# EAGLE design Schematic (EAGLE 9.5.2)
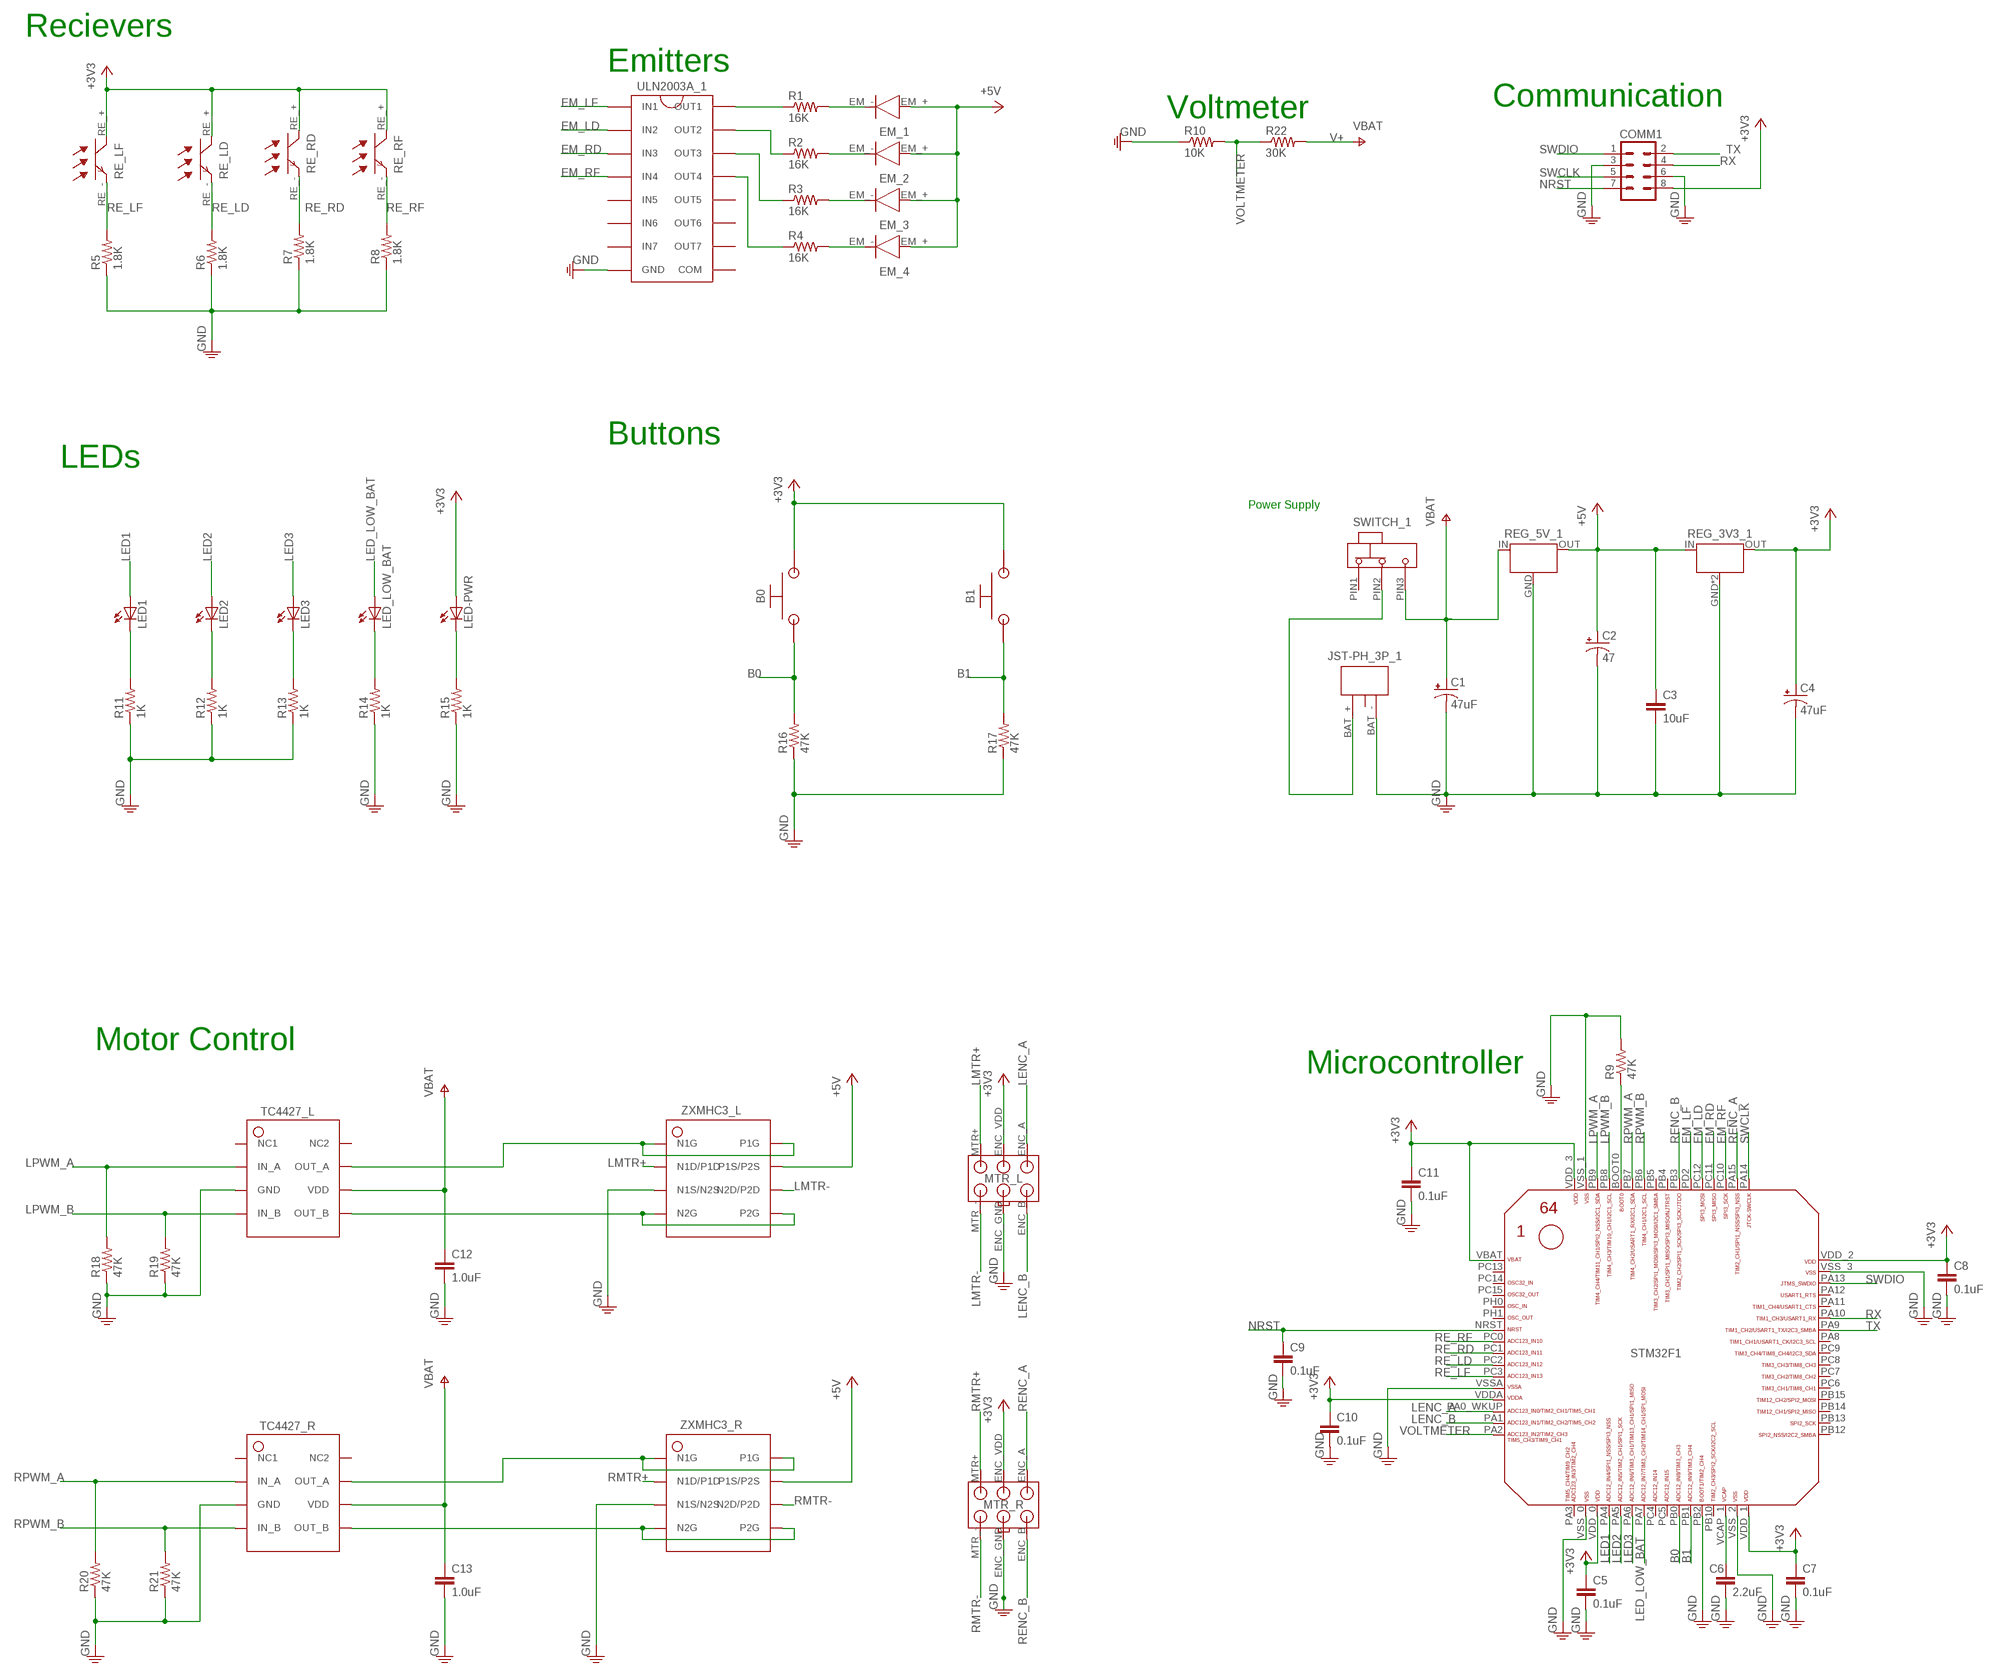
[diagram p0: schematic, sheet 1]

## Parts
B0  POLOLU_BUTTON  [POLOLU_BUTTON]
B1  POLOLU_BUTTON  [POLOLU_BUTTON]
C1  47uF  CAP_TANT_1210IN_3528MM  [CAP_TANT_1210IN_3528MM]
C2  47  CAP_TANT_1210IN_3528MM  [CAP_TANT_1210IN_3528MM]
C3  10uF  CAP_CERAMIC_0805IN_2012MM  [0805]
C4  47uF  CAP_TANT_1210IN_3528MM  [CAP_TANT_1210IN_3528MM]
C5  0.1uF  CAP_CERAMIC_0805IN_2012MM  [0805]
C6  2.2uF  CAP_CERAMIC_0805IN_2012MM  [0805]
C7  0.1uF  CAP_CERAMIC_0805IN_2012MM  [0805]
C8  0.1uF  CAP_CERAMIC_0805IN_2012MM  [0805]
C9  0.1uF  CAP_CERAMIC_0805IN_2012MM  [0805]
C10  0.1uF  CAP_CERAMIC_0805IN_2012MM  [0805]
C11  0.1uF  CAP_CERAMIC_0805IN_2012MM  [0805]
C12  1.0uF  CAP_CERAMIC_0805IN_2012MM  [0805]
C13  1.0uF  CAP_CERAMIC_0805IN_2012MM  [0805]
COMM1  M04X2  [2X4]
EM_1  SFH4545  [EMITTER]
EM_2  SFH4545  [EMITTER]
EM_3  SFH4545  [EMITTER]
EM_4  SFH4545  [EMITTER]
JST-PH_3P_1  3PIN  [B3B-PH-K-S]
LED1  LED  [LED-0805]
LED2  LED  [LED-0805]
LED3  LED  [LED-0805]
LED-PWR  LED  [LED-0805]
LED_LOW_BAT  LED  [LED-0805]
MTR_L  MOTOR_ENCODER_HEADER  [MOTOR_ENCODER_HEADER]
MTR_R  MOTOR_ENCODER_HEADER  [MOTOR_ENCODER_HEADER]
R1  16K  RESISTOR_0805IN_2012MM  [0805]
R2  16K  RESISTOR_0805IN_2012MM  [0805]
R3  16K  RESISTOR_0805IN_2012MM  [0805]
R4  16K  RESISTOR_0805IN_2012MM  [0805]
R5  1.8K  RESISTOR_0805IN_2012MM  [0805]
R6  1.8K  RESISTOR_0805IN_2012MM  [0805]
R7  1.8K  RESISTOR_0805IN_2012MM  [0805]
R8  1.8K  RESISTOR_0805IN_2012MM  [0805]
R9  47K  RESISTOR_0805IN_2012MM  [0805]
R10  10K  RESISTOR_0805IN_2012MM  [0805]
R11  1K  RESISTOR_0805IN_2012MM  [0805]
R12  1K  RESISTOR_0805IN_2012MM  [0805]
R13  1K  RESISTOR_0805IN_2012MM  [0805]
R14  1K  RESISTOR_0805IN_2012MM  [0805]
R15  1K  RESISTOR_0805IN_2012MM  [0805]
R16  47K  RESISTOR_0805IN_2012MM  [0805]
R17  47K  RESISTOR_0805IN_2012MM  [0805]
R18  47K  RESISTOR_0805IN_2012MM  [0805]
R19  47K  RESISTOR_0805IN_2012MM  [0805]
R20  47K  RESISTOR_0805IN_2012MM  [0805]
R21  47K  RESISTOR_0805IN_2012MM  [0805]
R22  30K  RESISTOR_0805IN_2012MM  [0805]
RE_LD  TEFT4300  [RECEIVER]
RE_LF  TEFT4300  [RECEIVER]
RE_RD  TEFT4300  [RECEIVER]
RE_RF  TEFT4300  [RECEIVER]
REG_3V3_1  3V3_REG  [SOT223]
REG_5V_1  REG_5V_MURATA  [5V_REG_MURATA]
STM32F1  STM32F4_401_410_411_412_413_446  [LQFP64]
SWITCH_1  POLOLU_SWITCH  [POLOLU_SWITCH]
TC4427_L  TC4427_SOIC8  [TC4427_SOIC8]
TC4427_R  TC4427_SOIC8  [TC4427_SOIC8]
ULN2003A_1  ULN2003A  [ULN2003A]
ZXMHC3_L  ZXMHC3  [ZXMHC3]
ZXMHC3_R  ZXMHC3  [ZXMHC3]

## Nets
+3V3: B0.P$2 B1.P$2 C4.A(+) C5.1 C7.1 C8.1 C10.1 C11.1 COMM1.8 LED-PWR.A MTR_L.ENC_VDD MTR_R.ENC_VDD RE_LD.RE_+(C) RE_LF.RE_+(C) RE_RD.RE_+(C) RE_RF.RE_+(C) REG_3V3_1.OUT STM32F1.VBAT STM32F1.VDD_0 STM32F1.VDD_1 STM32F1.VDD_2 STM32F1.VDD_3 STM32F1.VDDA
+5V: C2.A(+) C3.1 EM_1.EM_+(+) EM_2.EM_+(+) EM_3.EM_+(+) EM_4.EM_+(+) REG_3V3_1.IN REG_5V_1.OUT ZXMHC3_L.P1S/P2S ZXMHC3_R.P1S/P2S
B0: B0.P$1 R16.2 STM32F1.PB0
B1: B1.P$1 R17.2 STM32F1.PB1
EM_LD: STM32F1.PC12 ULN2003A_1.2B(IN2)
EM_LF: STM32F1.PD2 ULN2003A_1.1B(IN1)
EM_RD: STM32F1.PC11 ULN2003A_1.3B(IN3)
EM_RF: STM32F1.PC10 ULN2003A_1.4B(IN4)
GND: C1.C(-) C2.C(-) C3.2 C4.C(-) C5.2 C6.2 C7.2 C8.2 C9.2 C10.2 C11.2 C12.2 C13.2 COMM1.3 COMM1.6 JST-PH_3P_1.BAT_- MTR_L.ENC_GND MTR_R.ENC_GND R5.1 R6.1 R7.1 R8.1 R9.2 R10.1 R11.1 R12.1 R13.1 R14.1 R15.1 R16.1 R17.1 R18.1 R19.1 R20.1 R21.1 REG_3V3_1.GND REG_3V3_1.GND2(GND) REG_5V_1.GND STM32F1.PB2 STM32F1.VSS_0 STM32F1.VSS_1 STM32F1.VSS_2(VCAP_1) STM32F1.VSS_3(VCAP_2) STM32F1.VSSA TC4427_L.GND TC4427_R.GND ULN2003A_1.GND ZXMHC3_L.N1S/N2S ZXMHC3_R.N1S/N2S
LED1: LED1.A STM32F1.PA4
LED2: LED2.A STM32F1.PA5
LED3: LED3.A STM32F1.PA6
LED_LOW_BAT: LED_LOW_BAT.A STM32F1.PA7
LENC_A: MTR_L.ENC_A STM32F1.PA0_WKUP(PA0_AKUP)
LENC_B: MTR_L.ENC_B STM32F1.PA1
LMTR+: MTR_L.MTR+(MTR_+) ZXMHC3_L.N1D/P1D
LMTR-: MTR_L.MTR_- ZXMHC3_L.N2D/P2D
LPWM_A: R18.2 STM32F1.PB9 TC4427_L.IN_A
LPWM_B: R19.2 STM32F1.PB8 TC4427_L.IN_B
N$1: R1.1 ULN2003A_1.1C(OUT1)
N$2: R2.1 ULN2003A_1.2C(OUT2)
N$3: R3.1 ULN2003A_1.3C(OUT3)
N$4: R4.1 ULN2003A_1.4C(OUT4)
N$5: EM_1.EM_-(-) R1.2
N$6: EM_2.EM_-(-) R2.2
N$7: EM_3.EM_-(-) R3.2
N$8: EM_4.EM_-(-) R4.2
N$9: JST-PH_3P_1.BAT_+ SWITCH_1.PIN2
N$15: R9.1 STM32F1.BOOT0
N$16: C6.1 STM32F1.VCAP_1(PB11)
N$17: TC4427_L.OUT_B ZXMHC3_L.N2G ZXMHC3_L.P2G
N$18: TC4427_L.OUT_A ZXMHC3_L.N1G ZXMHC3_L.P1G
N$19: TC4427_R.OUT_A ZXMHC3_R.N1G ZXMHC3_R.P1G
N$20: TC4427_R.OUT_B ZXMHC3_R.N2G ZXMHC3_R.P2G
N$21: LED1.C R11.2
N$22: LED2.C R12.2
N$23: LED3.C R13.2
N$24: LED_LOW_BAT.C R14.2
N$25: LED-PWR.C R15.2
NRST: C9.1 COMM1.7 STM32F1.NRST
RE_LD: R6.2 RE_LD.RE_-(E) STM32F1.PC2
RE_LF: R5.2 RE_LF.RE_-(E) STM32F1.PC3
RE_RD: R7.2 RE_RD.RE_-(E) STM32F1.PC1
RE_RF: R8.2 RE_RF.RE_-(E) STM32F1.PC0
RENC_A: MTR_R.ENC_A STM32F1.PA15
RENC_B: MTR_R.ENC_B STM32F1.PB3
RMTR+: MTR_R.MTR+(MTR_+) ZXMHC3_R.N1D/P1D
RMTR-: MTR_R.MTR_- ZXMHC3_R.N2D/P2D
RPWM_A: R20.2 STM32F1.PB7 TC4427_R.IN_A
RPWM_B: R21.2 STM32F1.PB6 TC4427_R.IN_B
RX: COMM1.4 STM32F1.PA10
SWCLK: COMM1.5 STM32F1.PA14
SWDIO: COMM1.1 STM32F1.PA13
TX: COMM1.2 STM32F1.PA9
V+: C1.A(+) C12.1 C13.1 R22.2 REG_5V_1.IN SWITCH_1.PIN3 TC4427_L.VDD TC4427_R.VDD ; supply symbol labelled VBAT
VOLTMETER: R10.2 R22.1 STM32F1.PA2
Unconnected: STM32F1.PA3 STM32F1.PA8 STM32F1.PA11 STM32F1.PA12 STM32F1.PB4 STM32F1.PB5 STM32F1.PB10 STM32F1.PB12 STM32F1.PB13 STM32F1.PB14 STM32F1.PB15 STM32F1.PC4 STM32F1.PC5 STM32F1.PC6 STM32F1.PC7 STM32F1.PC8 STM32F1.PC9 STM32F1.PC13 STM32F1.PC14 STM32F1.PC15 STM32F1.PH0 STM32F1.PH1 SWITCH_1.PIN1 TC4427_L.NC1 TC4427_L.NC2 TC4427_R.NC1 TC4427_R.NC2 ULN2003A_1.5B(IN5) ULN2003A_1.5C(OUT5) ULN2003A_1.6B(IN6) ULN2003A_1.6C(OUT6) ULN2003A_1.7B(IN7) ULN2003A_1.7C(OUT7) ULN2003A_1.COM

## Notes on the sheet
- Recievers
- Emitters
- Communication
- Voltmeter
- Buttons
- LEDs
- Power Supply
- Motor Control
- Microcontroller

## Library data of the parts
B0 B1 = POLOLU_BUTTON:POLOLU_BUTTON
C1 C2 C4 = CAP_TANT_1210IN_3528MM:CAP_TANT_1210IN_3528MM
C3 C5-C13 = CAP_CERAMIC_0805IN_2012MM:CAP_CERAMIC_0805IN_2012MM
COMM1 = 2X4_PIN_HEADER:M04X2
EM_1-EM_4 = SFH4545:SFH4545
JST-PH_3P_1 = BATT_JST-PH_3PIN:3PIN
LED1-LED3 LED-PWR LED_LOW_BAT = LED_0805:LED
MTR_L MTR_R = MOTOR_ENCODER_HEADER:MOTOR_ENCODER_HEADER
R1-R22 = RESISTOR_0805IN_2012MM:RESISTOR_0805IN_2012MM
RE_LD RE_LF RE_RD RE_RF = TEFT4300:TEFT4300
REG_3V3_1 = REG_3V3_LM3940:3V3_REG: 1A Low Dropout Regulator for 5V to 3.3V Conversion
REG_5V_1 = REG_5V_MURATA:REG_5V_MURATA
STM32F1 = STM32F4_401_410_411_412_413_446:STM32F4_401_410_411_412_413_446
SWITCH_1 = POLOLU_SWITCH:POLOLU_SWITCH
TC4427_L TC4427_R = TC4427:TC4427_SOIC8
ULN2003A_1 = ULN2003A:ULN2003A
ZXMHC3_L ZXMHC3_R = ZXMHC3:ZXMHC3

## Board
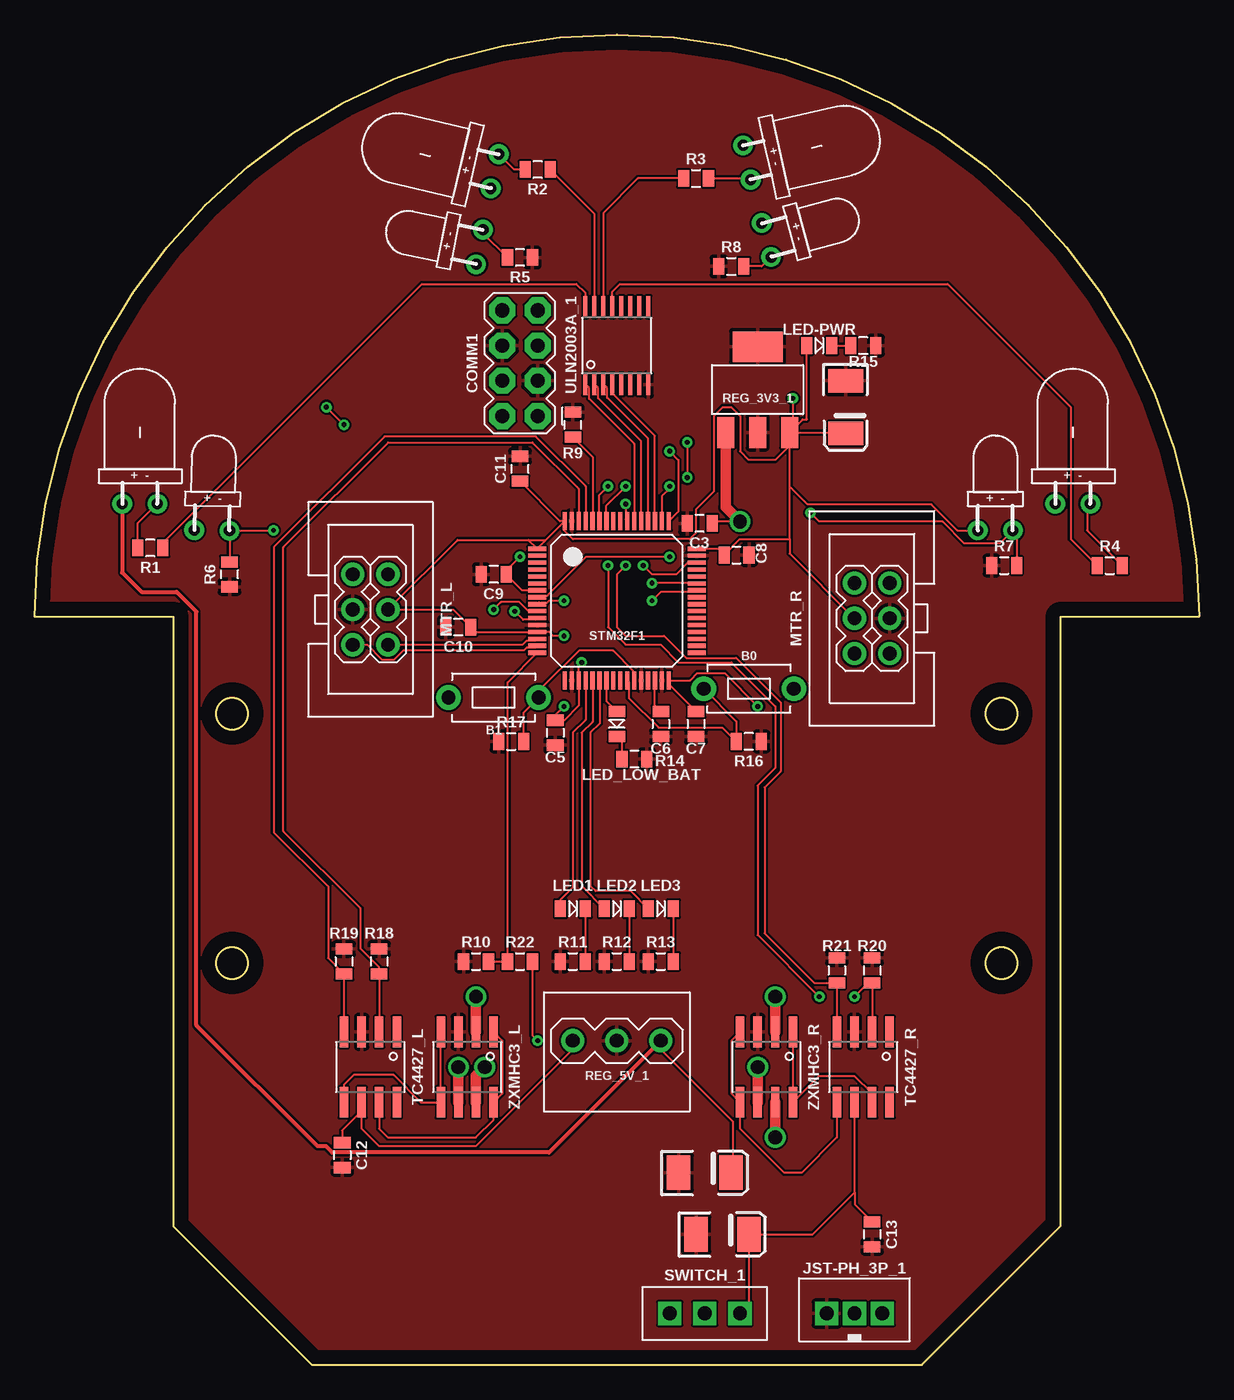
[diagram p1: board, top side]
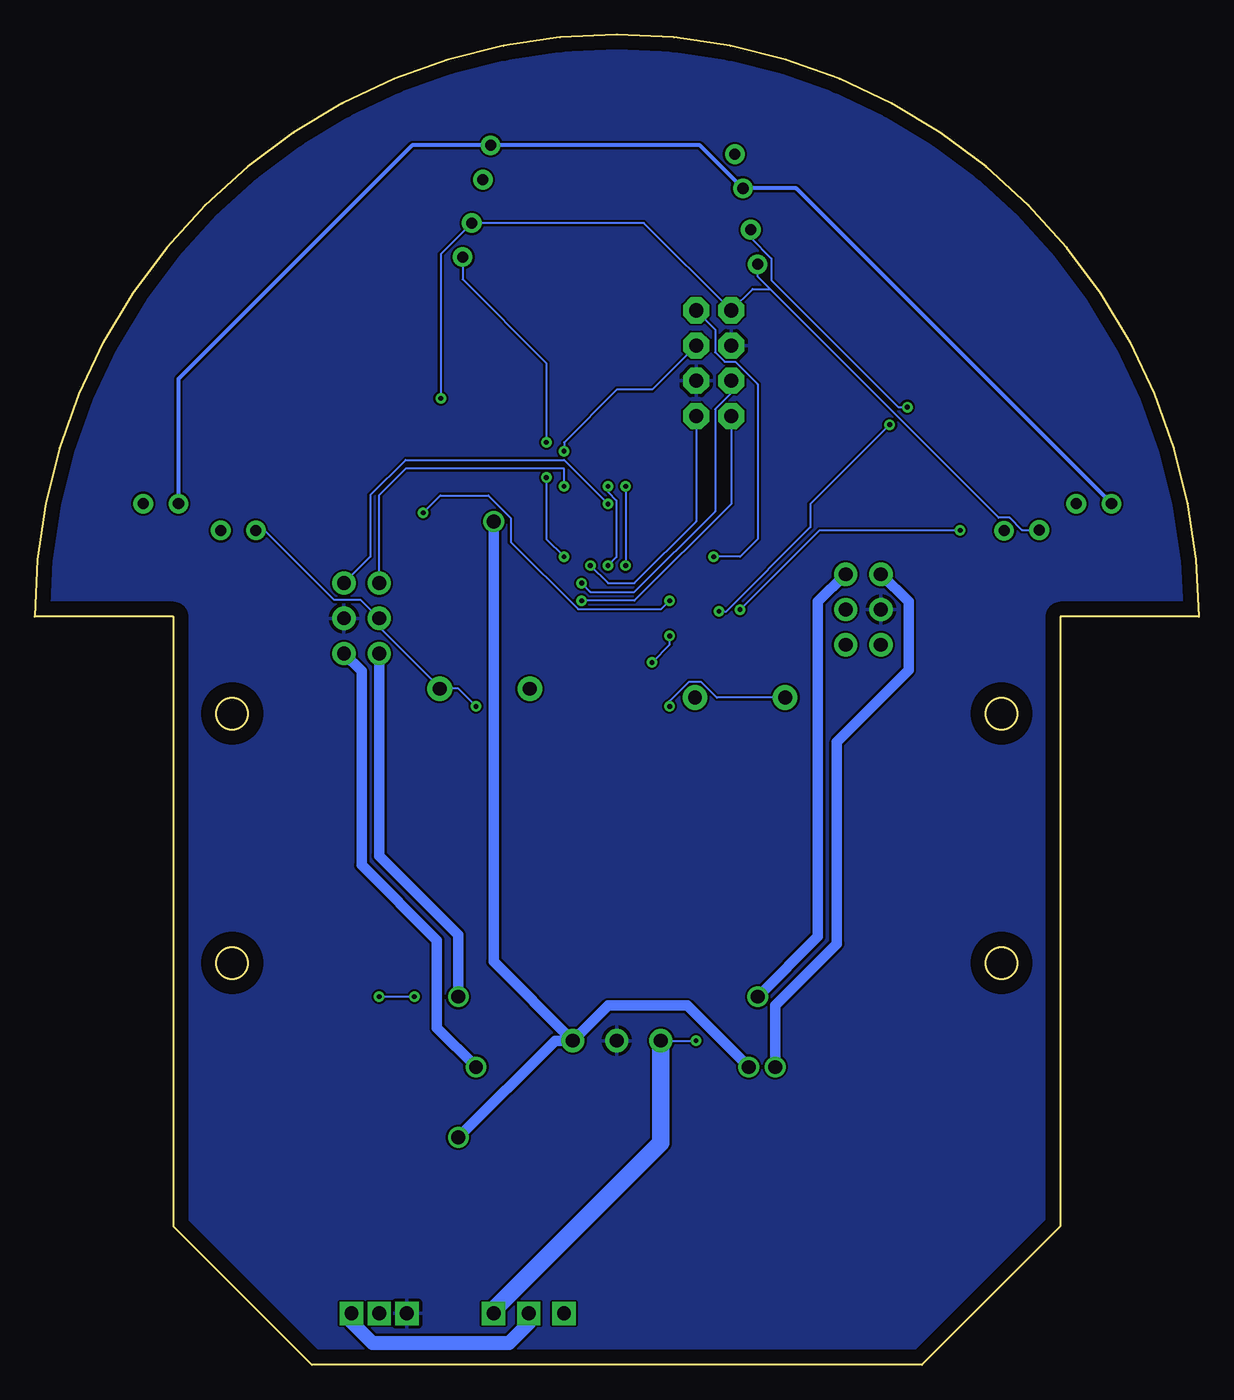
[diagram p2: board, bottom side, seen from below]

Size 84 x 96 mm. Coordinates in mm from the lower left corner, seen from the top.
Copper layers (1*16): Top 0.035mm / dielectric 1.5mm / Bottom 0.035mm
Design rules "default": minimum track width 6mil, minimum drill 0.35mm, track to track 6mil, track to pad 6mil, pad to pad 6mil, via to via 6mil, smd to smd 6mil, copper to edge 40mil, drill to drill 6mil, minimum pad ring 10mil, minimum via ring 8mil, stop-mask expansion 4mil, vias tented up to drill 0mil, thermal gap 10mil

### Footprints (pad centres in the part's own frame; a part is rotated, then mirrored left to right if it is on the bottom)
POLOLU_BUTTON = drill 1 pad 1.778: P$1 -3.25,0; P$2 3.25,0
CAP_TANT_1210IN_3528MM = smd 1.7 x 2.5: A 1.9,0; C -1.9,0
0805 = smd 0.8 x 1.2: 1 -0.9,0; 2 0.9,0
2X4 = drill 1.016 pad 1.88 octagon: 1 -3.81,-1.27; 2 -3.81,1.27; 3 -1.27,-1.27; 4 -1.27,1.27; 5 1.27,-1.27; 6 1.27,1.27; 7 3.81,-1.27; 8 3.81,1.27
EMITTER = drill 0.8 pad 1.422: EM_+ -1.397,0.016; EM_- 1.143,0.016
B3B-PH-K-S = drill 1 pad 1.676 square: BAT_+ 2,0; BAT_- -2,0; NC 0,0
LED-0805 = smd 0.8 x 1.2: A -0.9,0; C 0.9,0
MOTOR_ENCODER_HEADER = drill 1 pad 1.676: ENC_A 2.54,1.27; ENC_B 2.54,-1.27; ENC_GND 0,-1.27; ENC_VDD 0,1.27; MTR+ -2.54,1.27; MTR_- -2.54,-1.27
RECEIVER = drill 0.8 pad 1.422: RE_+ -1.27,0; RE_- 1.27,0
SOT223 = smd 1.219 x 2.235: GND 0,-3.099; IN -2.311,-3.099; OUT 2.311,-3.099 | smd 3.6 x 2.2: GND2 0,3.099
5V_REG_MURATA = drill 1 pad 1.676: GND 0,0; IN -3.175,0; OUT 3.175,0
LQFP64 = smd 0.3 x 1.3: BOOT0 -1.75,5.75; PA3 -3.75,-5.75; PA4 -2.25,-5.75; PA5 -1.75,-5.75; PA6 -1.25,-5.75; PA7 -0.75,-5.75; PA14 3.75,5.75; PA15 3.25,5.75; PB0 0.75,-5.75; PB1 1.25,-5.75; PB2 1.75,-5.75; PB3 0.75,5.75; PB4 0.25,5.75; PB5 -0.25,5.75; PB6 -0.75,5.75; PB7 -1.25,5.75; PB8 -2.25,5.75; PB9 -2.75,5.75; PB10 2.25,-5.75; PC4 -0.25,-5.75; PC5 0.25,-5.75; PC10 2.75,5.75; PC11 2.25,5.75; PC12 1.75,5.75; PD2 1.25,5.75; VCAP_1 2.75,-5.75; VDD_0 -2.75,-5.75; VDD_1 3.75,-5.75; VDD_3 -3.75,5.75; VSS_0 -3.25,-5.75; VSS_1 -3.25,5.75; VSS_2 3.25,-5.75 | smd 1.3 x 0.3: NRST -5.75,0.75; PA0_WKUP -5.75,-2.75; PA1 -5.75,-3.25; PA2 -5.75,-3.75; PA8 5.75,0.25; PA9 5.75,0.75; PA10 5.75,1.25; PA11 5.75,1.75; PA12 5.75,2.25; PA13 5.75,2.75; PB12 5.75,-3.75; PB13 5.75,-3.25; PB14 5.75,-2.75; PB15 5.75,-2.25; PC0 -5.75,0.25; PC1 -5.75,-0.25; PC2 -5.75,-0.75; PC3 -5.75,-1.25; PC6 5.75,-1.75; PC7 5.75,-1.25; PC8 5.75,-0.75; PC9 5.75,-0.25; PC13 -5.75,3.25; PC14 -5.75,2.75; PC15 -5.75,2.25; PH0 -5.75,1.75; PH1 -5.75,1.25; VBAT -5.75,3.75; VDD_2 5.75,3.75; VDDA -5.75,-2.25; VSS_3 5.75,3.25; VSSA -5.75,-1.75
POLOLU_SWITCH = drill 1 pad 1.676 square: PIN1 -2.54,0; PIN2 0,0; PIN3 2.54,0
TC4427_SOIC8 = smd 0.61 x 2.21: GND 0.635,-2.54; IN_A -0.635,-2.54; IN_B 1.905,-2.54; NC1 -1.905,-2.54; NC2 -1.905,2.54; OUT_A -0.635,2.54; OUT_B 1.905,2.54; VDD 0.635,2.54
ULN2003A = smd 1.55 x 0.3: 1B -2.8,2.275; 1C 2.8,2.275; 2B -2.8,1.625; 2C 2.8,1.625; 3B -2.8,0.975; 3C 2.8,0.975; 4B -2.8,0.325; 4C 2.8,0.325; 5B -2.8,-0.325; 5C 2.8,-0.325; 6B -2.8,-0.975; 6C 2.8,-0.975; 7B -2.8,-1.625; 7C 2.8,-1.625; COM 2.8,-2.275; GND -2.8,-2.275
ZXMHC3 = smd 0.61 x 2.21: N1D/P1D -0.635,-2.54; N1G -1.905,-2.54; N1S/N2S 0.635,-2.54; N2D/P2D 0.635,2.54; N2G 1.905,-2.54; P1G -1.905,2.54; P1S/P2S -0.635,2.54; P2G 1.905,2.54

### Placement (x,y rotation side)
B0  51.52,48.8 0 top
B1  33.11,48.16 180 top
C1  49.62,9.43 0 top
C2  48.35,13.87 0 top
C3  47.97,60.73 180 top
C4  58.51,69.11 270 top
C5  37.55,45.62 270 top
C6  45.17,46.25 270 top
C7  47.71,46.25 270 top
C8  50.64,58.45 0 top
C9  33.11,57.05 180 top
C10  30.57,53.24 180 top
C11  35.02,64.67 90 top
C12  22.19,15.14 270 top
C13  60.41,9.43 270 top
COMM1  35.02,72.29 90 top
EM_1  7.71,62.13 0 top
EM_2  33.24,86.26 76.7 top
EM_3  51.4,86.64 282.6 top
EM_4  75.02,62.13 0 top
JST-PH_3P_1  59.14,3.71 0 top
LED1  38.82,32.92 0 top
LED2  42,32.92 0 top
LED3  45.17,32.92 0 top
LED-PWR  56.6,73.56 0 top
LED_LOW_BAT  42,46.25 270 top
MTR_L  24.22,54.51 270 top
MTR_R  60.41,53.88 90 top
R1  8.34,58.95 180 top
R2  36.28,86.26 180 top
R3  47.71,85.62 0 top
R4  77.56,57.69 0 top
R5  35.02,79.91 180 top
R6  14.06,57.05 90 top
R7  69.94,57.69 0 top
R8  50.25,79.28 0 top
R9  38.82,67.84 90 top
R10  31.84,29.11 0 top
R11  38.82,29.11 0 top
R12  42,29.11 0 top
R13  45.17,29.11 0 top
R14  43.27,43.72 180 top
R15  59.78,73.56 180 top
R16  51.52,44.98 180 top
R17  34.38,44.98 0 top
R18  24.85,29.11 270 top
R19  22.31,29.11 270 top
R20  60.41,28.48 270 top
R21  57.88,28.48 270 top
R22  35.02,29.11 0 top
RE_LD  12.79,60.22 358.7 top
RE_LF  32.09,80.67 78.7 top
RE_RD  69.31,60.22 0 top
RE_RF  52.8,81.18 285.3 top
REG_3V3_1  52.16,70.39 0 top
REG_5V_1  42,23.4 0 top
STM32F1  42,55.14 0 top
SWITCH_1  48.35,3.71 0 top
TC4427_L  24.22,21.49 180 top
TC4427_R  59.78,21.49 180 top
U$2  [MOUSE_OUTLINE_2WHEEL]  42,38 0 top
ULN2003A_1  42,73.56 90 top
ZXMHC3_L  31.2,21.49 180 top
ZXMHC3_R  52.8,21.49 180 top

### Tracks (layer width: path | path; a pad name or v marks a point on that pad's centre or on a via)
+3V3  (via drill 0.35)
  Top 0.152: C11.1 37.89,60.89 STM32F1.VDD_3 38.2,60.85 | STM32F1.VDD_2 49.4,58.89 C8.1 50.88,59.59 54.47,59.59 | C7.1 45.75,49.12 STM32F1.VDD_1 47.29,49.39 47.81,49.91 49.77,49.91 v52.16,47.53 | 35.61,59.53 STM32F1.VBAT 36.88,59.53 | 35.61,59.53 30.51,59.53 MTR_L.ENC_VDD 30.2,54.51 C10.1 31.81,52.89 STM32F1.VDDA 37.14,52.89 37.43,52.61 v38.19,52.61 | 35.61,59.53 36.88,59.53 | 36.88,59.53 38.2,60.85 | LED-PWR.A 55.7,68.22 55.41,68.22 REG_3V3_1.OUT | 54.47,59.59 54.47,63.4 | 38.2,60.85 38.2,60.21 38.82,59.59 47.25,59.59 47.71,60.06 47.71,61.75 49.01,63.05 49.01,68.5 49.63,69.11 50.25,69.11 50.89,68.48 50.89,65.94 51.52,65.31 53.43,65.31 54.47,66.35 REG_3V3_1.OUT | v38.19,47.53 37.55,46.89 C5.1 38.19,46.52 39.25,47.58 STM32F1.VDD_0 39.25,50.49 v39.46,50.7 | 54.47,59.59 54.47,58.55 MTR_R.ENC_VDD | 54.47,63.4 55.77,62.1 64.68,62.1 66.56,60.22 RE_RD.RE_+ | REG_3V3_1.OUT 58.44,67.29 C4.A | v54.7,69.75 54.7,67.52 REG_3V3_1.OUT | 54.47,63.4 REG_3V3_1.OUT
  Bottom 0.152: RE_LD.RE_+ 12.78,60.25 13.67,61.14 14.45,61.14 30.94,77.63 | 30.94,77.63 31.84,78.54 RE_LF.RE_+ | 30.94,77.63 32.21,77.63 COMM1.8 40.05,82.41 RE_RF.RE_+ 54.7,80.17 v54.7,69.75 | B1.P$2 34.78,48.16 35.9,49.28 36.82,49.28 38.19,47.91 v38.19,47.53 | v52.16,47.53 53.43,48.8 54.7,48.8 | 54.7,48.8 B0.P$2 | 54.7,48.8 59.14,53.24 MTR_R.ENC_VDD 60.48,55.21 62.39,55.21 67.4,60.22 RE_RD.RE_+ | v39.46,50.7 38.19,51.97 v38.19,52.61
+5V  (via drill 1)
  Top 0.152: REG_5V_1.OUT 45.17,22.76 50.36,17.58 50.36,13.98 C2.A | v50.89,60.86 49,60.86 C3.1
  Top 0.305: REG_5V_1.OUT 37.11,15.34 21.46,15.34 21.02,15.78 20.41,15.78 11.67,24.51 11.67,54.36 10.25,55.78 7.71,55.78 6.31,57.18 EM_1.EM_+
  Top 0.762: REG_3V3_1.IN 49.85,61.9 v50.89,60.86 | v32.47,21.49 31.84,20.86 ZXMHC3_L.P1S/P2S | ZXMHC3_R.P1S/P2S v53.43,16.41
  Bottom 0.305: EM_4.EM_+ 73.62,71.15 56.76,88.01 EM_3.EM_+ 36,88.01 EM_2.EM_+ 29.07,84.9 EM_1.EM_+
  Bottom 0.762: v50.89,60.86 50.89,29.11 REG_5V_1.OUT | REG_5V_1.OUT 42.63,25.94 36.92,25.94 v32.47,21.49 | v53.43,16.41 46.44,23.4 REG_5V_1.OUT
B0
  Top 0.152: STM32F1.PB0 42.87,49.27 42.87,48.14 45.02,45.99 49.62,45.99 R16.2 50.62,46.45 B0.P$1
B1
  Top 0.152: R17.2 35.28,47.08 B1.P$1 36.6,48.4 36.6,48.87 39.27,51.54 41.72,51.54 43.18,50.09 43.18,49.47 STM32F1.PB1
EM_LD
  Top 0.152: STM32F1.PC12 43.75,66.66 40.65,69.76 40.65,70.49 ULN2003A_1.2B
EM_LF
  Top 0.152: STM32F1.PD2 43.25,66.48 40,69.73 40,70.49 ULN2003A_1.1B
EM_RD
  Top 0.152: STM32F1.PC11 44.25,66.85 41.3,69.8 41.3,70.49 ULN2003A_1.3B
EM_RF
  Top 0.152: ULN2003A_1.4B 41.67,70.12 44.75,67.05 STM32F1.PC10
GND
  pour Top (isolate 0): -10.54,102.14 101.69,102.14 101.69,18.95 66.13,-16.61 13.42,-16.61 -10.54,7.35
  pour Bottom (isolate 0): 1.87,104.68 92.8,104.68 92.8,-2.64 82.64,-12.8 7.07,-12.8 -9.44,3.71 -9.44,93.37
LED1
  Top 0.152: STM32F1.PA4 39.75,46.55 38.82,45.62 38.82,34.45 37.92,33.55 LED1.A
LED2
  Top 0.152: STM32F1.PA5 40.25,46.41 39.46,45.62 39.46,34.56 LED2.A
LED3
  Top 0.152: STM32F1.PA6 40.75,46.28 40.09,45.62 40.09,34.56 40.46,34.19 43,34.19 LED3.A
LED_LOW_BAT
  Top 0.152: STM32F1.PA7 41.25,47.91 LED_LOW_BAT.A
LENC_A
  Top 0.152: STM32F1.PA0_WKUP 36.13,52.27 35.5,52.27 35.2,51.97 MTR_L.ENC_A
LENC_B
  Top 0.152: MTR_L.ENC_B 23.98,51.97 25.05,50.9 25.93,50.9 26.62,51.59 35.32,51.59 35.5,51.77 36.13,51.77 STM32F1.PA1
LMTR+  (via drill 1)
  Top 0.762: ZXMHC3_L.N1D/P1D v31.84,26.57
  Bottom 0.762: MTR_L.MTR+ 25.52,57.05 27.5,55.08 27.5,30.91 v31.84,26.57
LMTR-  (via drill 1)
  Top 0.762: ZXMHC3_L.N2D/P2D v30.57,21.49
  Bottom 0.762: v30.57,21.49 30.57,25.94 26.12,30.38 26.12,44.95 20.94,50.13 20.94,55.08 22.91,57.05 MTR_L.MTR_-
LPWM_A
  Top 0.152: TC4427_L.IN_A R18.2 24.85,28.69 23.52,30.02 23.52,32.94 17.95,38.51 17.95,59.02 25.5,66.58 35.9,66.58 39.25,63.23 STM32F1.PB9
LPWM_B
  Top 0.152: TC4427_L.IN_B R19.2 21.17,29.35 21.17,34.53 17.26,38.44 17.26,59.02 25.25,67.01 36.16,67.01 39.76,63.41 STM32F1.PB8
N$1
  Top 0.152: R1.1 9.31,59.02 9.31,59.39 27.94,78.01 39.09,78.01 39.72,77.38 ULN2003A_1.1C
N$2
  Top 0.152: R2.1 40.38,83.07 ULN2003A_1.2C
N$3
  Top 0.152: R3.1 43.52,85.62 41.02,83.13 ULN2003A_1.3C
N$4
  Top 0.152: R4.1 74.75,59.59 74.75,69.11 65.86,78.01 42.21,78.01 41.67,77.47 ULN2003A_1.4C
N$5
  Top 0.152: R1.2 7.44,60.74 EM_1.EM_-
N$6
  Top 0.152: R2.2 34.6,86.26 EM_2.EM_-
N$7
  Top 0.152: R3.2 51.57,85.62 EM_3.EM_-
N$8
  Top 0.152: EM_4.EM_- 75.92,61.9 75.92,60.22 R4.2
N$9
  Bottom 1.016: JST-PH_3P_1.BAT_+ 61.14,3.1 59.63,1.59 49.77,1.59 48.35,3.01 SWITCH_1.PIN2
N$15
  Top 0.152: R9.1 40.25,65.52 STM32F1.BOOT0
N$16
  Top 0.152: C6.1 44.75,47.58 STM32F1.VCAP_1
N$17
  Top 0.152: ZXMHC3_L.N2G ZXMHC3_L.P2G 27.86,18.95 25.89,20.92 23.01,20.92 22.31,20.22 TC4427_L.OUT_B
N$18
  Top 0.152: ZXMHC3_L.N1G 33.74,23.4 33.74,19.59 ZXMHC3_L.P1G 33.11,17.68 31.84,16.41 25.49,16.41 24.85,17.05 TC4427_L.OUT_A
N$19
  Top 0.152: ZXMHC3_R.N1G ZXMHC3_R.P1G 56.6,20.86 59.14,20.86 60.41,19.59 TC4427_R.OUT_A
N$20
  Top 0.152: ZXMHC3_R.N2G 50.25,23.4 50.25,19.59 ZXMHC3_R.P2G 50.89,17.05 54.06,13.87 55.33,13.87 57.88,16.41 TC4427_R.OUT_B
N$21
  Top 0.152: LED1.C R11.2
N$22
  Top 0.152: LED2.C R12.2
N$23
  Top 0.152: LED3.C R13.2
N$24
  Top 0.152: LED_LOW_BAT.C 42.37,44.98 R14.2
N$25
  Top 0.152: LED-PWR.C R15.2
NRST  (via drill 0.35)
  Top 0.152: STM32F1.NRST 35.16,55.89 C9.1 33.88,57.18 v35.02,58.32
  Bottom 0.152: COMM1.7 34.91,74.73 34.91,73.08 34.23,72.39 33.46,72.39 31.84,70.77 31.84,59.59 33.11,58.32 v35.02,58.32
RE_LD  (via drill 0.35)
  Top 0.152: RE_LD.RE_- | RE_LD.RE_- R6.2 | 14.06,60.22 v17.23,60.22 | 14.06,60.22 | RE_LD.RE_- 14.06,60.22 | STM32F1.PC2 35.61,54.39 34.97,55.04 33.64,55.04 v33.11,54.51
  Bottom 0.152: v17.23,60.22 27.39,60.22 v33.11,54.51
RE_LF  (via drill 0.35)
  Top 0.152: R5.2 32.34,81.68 RE_LF.RE_- | v21.04,69.11 v22.31,67.84 | v34.63,54.38 35.24,53.77 36.13,53.77 STM32F1.PC3
  Bottom 0.152: v21.04,69.11 21.68,69.11 30.85,78.28 30.85,79.84 32.34,81.34 RE_LF.RE_- | v22.31,67.84 28.03,62.13 28.03,60.45 34.09,54.38 v34.63,54.38
RE_RD  (via drill 0.35)
  Top 0.152: R7.2 70.84,59.96 RE_RD.RE_- 69.63,59.28 67.07,59.28 65.5,60.86 56.6,60.86 v55.97,61.5 | STM32F1.PC1 36.37,55.02 36.99,55.02 37.12,55.14 v38.19,55.14
  Bottom 0.152: v38.19,55.14 38.8,54.54 44.79,54.54 49.65,59.39 49.65,61.11 51.27,62.74 54.73,62.74 v55.97,61.5
RE_RF  (via drill 0.35)
  Top 0.152: RE_RF.RE_- 52.45,79.28 R8.2 | STM32F1.PC0 36.37,55.52 36.99,55.52 39.8,58.32 v45.81,58.32 | v47.08,66.58 v47.08,64.03
  Bottom 0.152: v47.08,64.03 47.08,59.59 v45.81,58.32 | RE_RF.RE_- 53.13,78.34 47.08,72.29 v47.08,66.58
RENC_A  (via drill 0.35)
  Top 0.152: v45.81,63.4 45.81,63.25 45.25,62.69 STM32F1.PA15
  Bottom 0.152: MTR_R.ENC_A 59.14,62.77 57.24,64.67 45.81,64.67 v45.81,63.4
RENC_B  (via drill 0.35)
  Top 0.152: STM32F1.PB3 42.63,61.01 v42.63,62.13
  Bottom 0.152: MTR_R.ENC_B 59.78,58.32 59.78,62.77 57.24,65.31 45.81,65.31 v42.63,62.13
RMTR+  (via drill 1)
  Top 0.762: v53.43,26.57 ZXMHC3_R.N1D/P1D
  Bottom 0.762: MTR_R.MTR+ 59.14,36.73 53.43,31.02 v53.43,26.57
RMTR-  (via drill 1)
  Top 0.762: v52.16,21.49 ZXMHC3_R.N2D/P2D
  Bottom 0.762: MTR_R.MTR_- 60.41,50.06 60.41,36.07 54.98,30.64 54.98,24.31 v52.16,21.49
RPWM_A  (via drill 0.35)
  Top 0.152: TC4427_R.IN_A R20.2 60.15,27.58 v59.14,26.57 | STM32F1.PB7 40.73,60.92 40.73,62.77 v41.36,63.4 | v41.36,57.69 41.36,53.24 42.63,51.97 45.17,51.97 46.44,50.7 50.25,50.7 53.43,47.53 53.43,43.08 52.16,41.81 52.16,31.02 v56.6,26.57
  Bottom 0.152: v41.36,63.4 v41.36,57.69 | v56.6,26.57 v59.14,26.57
RPWM_B  (via drill 0.35)
  Top 0.152: TC4427_R.IN_B R21.2 56.23,27.58 52.67,31.14 52.67,41.68 53.81,42.83 53.81,47.81 50.6,51.02 47,51.02 45.42,52.61 42.63,52.61 42,53.24 42,57.05 v42.63,57.69 | STM32F1.PB6 41.25,62.02 v42.63,63.4
  Bottom 0.152: v42.63,63.4 42.63,62.99 42.03,62.38 42.03,58.29 v42.63,57.69
RX  (via drill 0.35)
  Top 0.152: STM32F1.PA10 47.73,56.42 v44.54,56.42
  Bottom 0.152: COMM1.4 33.74,70.13 34.91,68.96 34.91,61.6 40.73,55.78 43.91,55.78 v44.54,56.42
SWCLK  (via drill 0.35)
  Top 0.152: v45.81,65.94 46.44,65.31 46.44,61.59 STM32F1.PA14
  Bottom 0.152: COMM1.5 39.46,70.39 42,70.39 45.81,66.58 v45.81,65.94
SWDIO  (via drill 0.35)
  Top 0.152: STM32F1.PA13 47.11,57.89 46.27,57.05 44.54,57.05 v43.91,57.69
  Bottom 0.152: v43.91,57.69 42.63,56.42 40.73,56.42 36.28,60.86 COMM1.1
TX  (via drill 0.35)
  Top 0.152: STM32F1.PA9 47.63,55.78 45.17,55.78 v44.54,55.14
  Bottom 0.152: COMM1.2 33.74,62.13 40.73,55.14 v44.54,55.14
V+  (via drill 0.35)
  Top 0.152: TC4427_R.VDD 59.17,18.93 59.17,12.45 | C12.1 22.19,16.92 23.58,18.32 TC4427_L.VDD 23.58,17.05 24.85,15.78 31.84,15.78 38.82,22.76 REG_5V_1.IN | SWITCH_1.PIN3 51.52,4.35 C1.A 56.15,9.43 59.17,12.45 | R22.2 35.91,23.77 v36.28,23.4 | 59.17,12.45 59.17,11.57 C13.1
  Bottom 0.152: REG_5V_1.IN v36.28,23.4
  Bottom 1.27: SWITCH_1.PIN3 50.89,3.96 38.82,16.03 REG_5V_1.IN
VOLTMETER
  Top 0.152: R10.2 R22.1 34.11,49.26 STM32F1.PA2